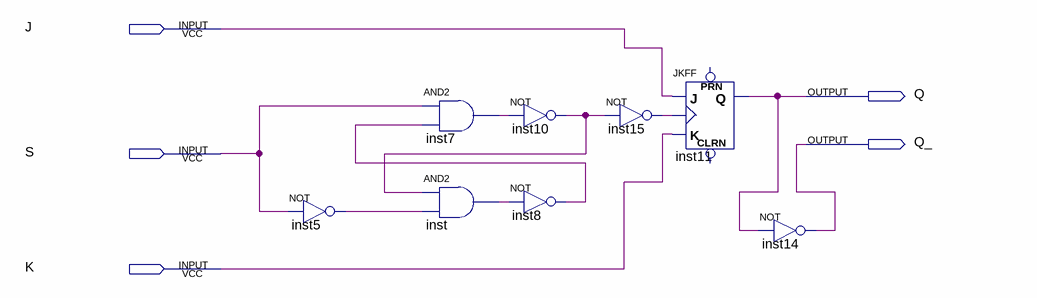
[diagram p0: schematic sheet]
// Quartus schematic JKFF.bdf as structural Verilog: 8 symbols, 5 pins
module JKFF (
  input  J,
  input  S,
  input  K,
  output Q,
  output Q_
);

  wire inst5_out, inst7_out, inst8_out, inst10_out, inst15_out, inst_out;

  not inst5 (inst5_out, S);
  and inst7 (inst7_out, S, inst8_out);
  and inst (inst_out, inst10_out, inst5_out);
  not inst10 (inst10_out, inst7_out);
  not inst8 (inst8_out, inst_out);
  not inst15 (inst15_out, inst10_out);
  JKFF inst11 (.K(K), .J(J), .CLK(inst15_out), .Q(Q));  // open: PRN, CLRN
  not inst14 (Q_, Q);
endmodule
